# EAGLE design Stepper Driver Board (EAGLE 6.6.0)
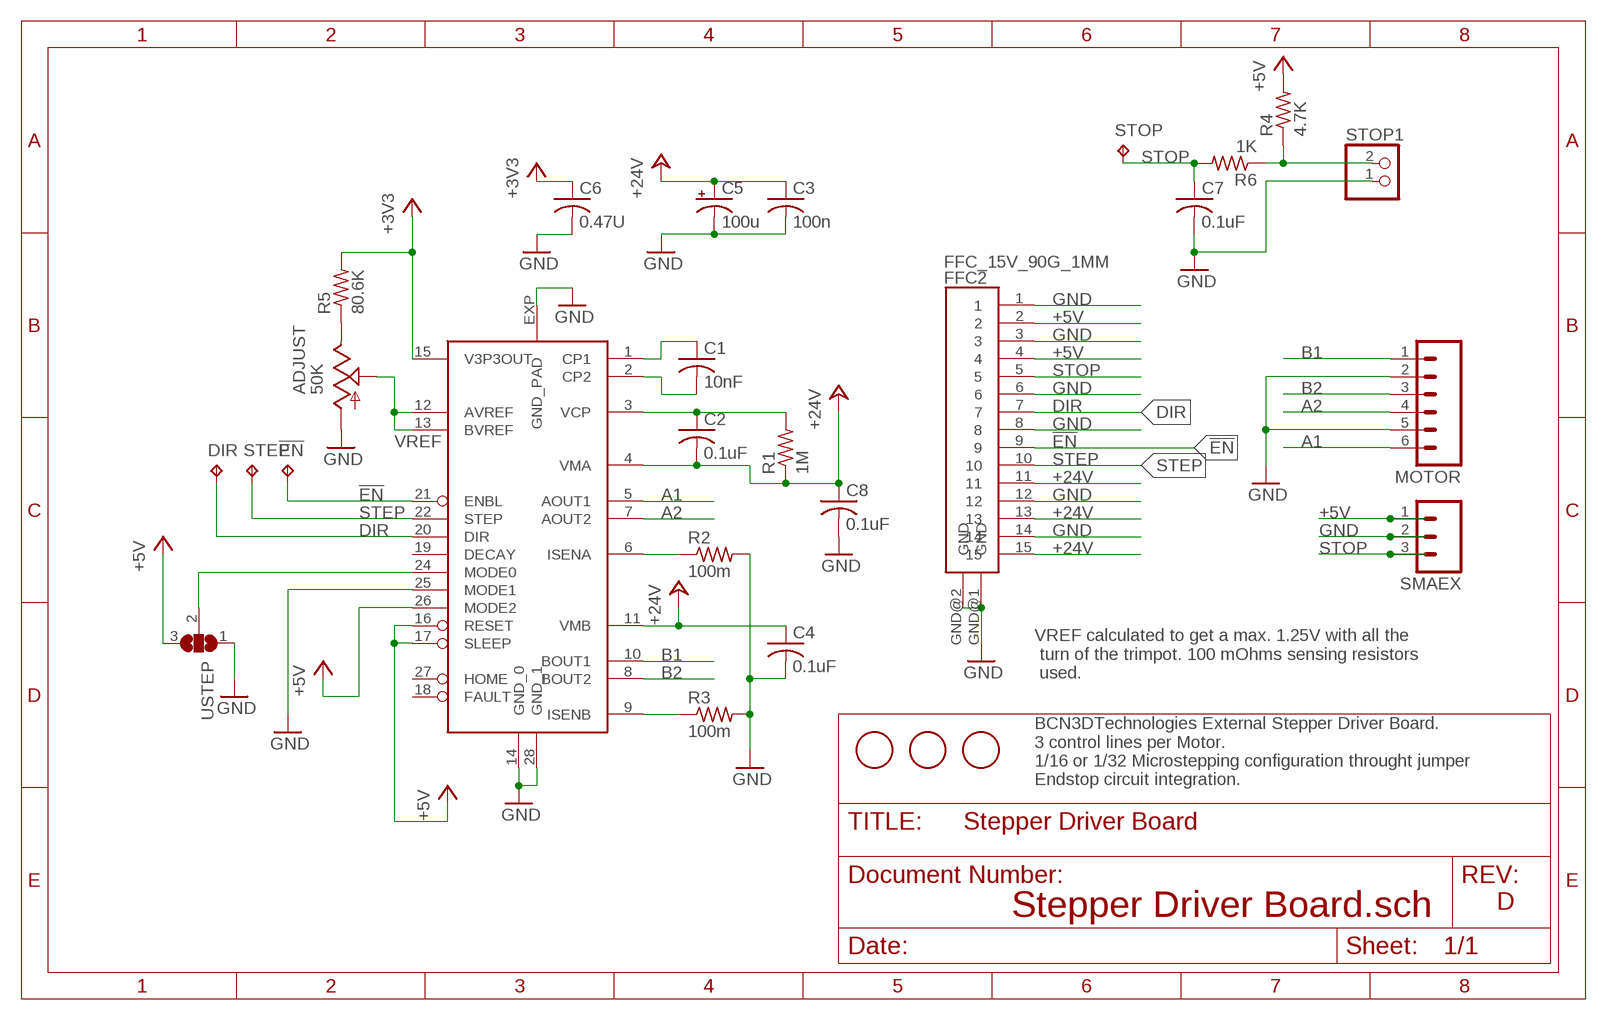
[diagram p0: schematic, sheet 1]

## Parts
!EN  TPB1,27  [B1,27]
ADJUST  50K  TRIM_US-3223G  [3223G]
C1  10nF  C-USC0805  [C0805]
C2  0.1uF  C-USC0805  [C0805]
C3  100n  C-USC0805  [C0805]
C4  0.1uF  C-USC0805  [C0805]
C5  100u  CPOL-USUD-6,3X7,7  [UD-6,3X7,7_NICHICON]
C6  0.47U  C-USC0805  [C0805]
C7  0.1uF  C-USC0805  [C0805]
C8  0.1uF  C-USC0805  [C0805]
DIR  TPB1,27  [B1,27]
FFC2  FFC_15V_90G_1MM  [TE_FFC_CON1MM]
IC1  DRV8825PWP  [TSSOP-28]
MOTOR  M06  [JST-6-PTH]
R1  1M  R-US_R0805  [R0805]
R2  100m  R-US_R1210  [R1210]
R3  100m  R-US_R1210  [R1210]
R4  4.7K  R-US_R0805  [R0805]
R5  80.6K  R-US_R0805  [R0805]
R6  1K  R-US_R0805  [R0805]
SMAEX  M03PTH  [1X03]
STEP  TPB1,27  [B1,27]
STOP  TPB1,27  [B1,27]
STOP1  JST_2PIN-THM-RA  [JST-PH-2-THM-RA]
U$2  FIDUCIAL  [FIDUCIAL_1MM]
U$3  FIDUCIAL  [FIDUCIAL_1MM]
U$4  FIDUCIAL  [FIDUCIAL_1MM]
USTEP  SJ2W  [SJ_2]

## Nets
!EN: !EN.TP FFC2.9 IC1.21(ENBL)
+3V3: C6.1 IC1.15(V3P3OUT) R5.2
+5V [Signal]: FFC2.2 FFC2.4 IC1.16(RESET) IC1.17(SLEEP) IC1.26(MODE2) R4.2 SMAEX.1 USTEP.3
+24V: C2.2 C3.1 C4.1 C5.+ C8.1 FFC2.11 FFC2.13 FFC2.15 IC1.4(VMA) IC1.11(VMB) R1.1
A1: IC1.5(AOUT1) MOTOR.6
A2: IC1.7(AOUT2) MOTOR.4
B1: IC1.10(BOUT1) MOTOR.1
B2: IC1.8(BOUT2) MOTOR.3
DIR: DIR.TP FFC2.7 IC1.20(DIR)
GND: ADJUST.1(A) C3.2 C4.2 C5.- C6.2 C7.2 C8.2 FFC2.1 FFC2.3 FFC2.6 FFC2.8 FFC2.12 FFC2.14 FFC2.GND@1(GND) FFC2.GND@2(GND) IC1.14(GND_0) IC1.25(MODE1) IC1.28(GND_1) IC1.EXP(GND_PAD) MOTOR.2 MOTOR.5 R2.2 R3.2 SMAEX.2 STOP1.1 USTEP.1
N$2: ADJUST.3(E) R5.1
N$4: IC1.24(MODE0) USTEP.2
N$7: IC1.6(ISENA) R2.1
N$8: IC1.9(ISENB) R3.1
N$11: C1.1 IC1.1(CP1)
N$12: C1.2 IC1.2(CP2)
N$14: C2.1 IC1.3(VCP) R1.2
N$25: R4.1 R6.1 STOP1.2
STEP: FFC2.10 IC1.22(STEP) STEP.TP
STOP: C7.1 FFC2.5 R6.2 SMAEX.3 STOP.TP
VREF: ADJUST.2(S) IC1.12(AVREF) IC1.13(BVREF)
Unconnected: IC1.18(FAULT) IC1.19(DECAY) IC1.27(HOME)

## Notes on the sheet
- VREF calculated to get a max. 1.25V with all the
   turn of the trimpot. 100 mOhms sensing resistors
   used.
- BCN3DTechnologies External Stepper Driver Board. 
  3 control lines per Motor.
  1/16 or 1/32 Microstepping configuration throught jumper
  Endstop circuit integration.
- D
- Stepper Driver Board.sch

## Library data of the parts
!EN DIR STEP STOP = testpad:TP: Test pad; OC_FARNELL: unknown
ADJUST = pot:TRIM_US-: POTENTIOMETER; MF: BOURNS; MPN: TC33X-2-503E; OC_FARNELL: 1689867
C1 = rcl:C-US: CAPACITOR, American symbol; MF: AVX; MPN: 06035C103JAT2A; OC_FARNELL: 1833871
C2-C4 C7 C8 = rcl:C-US: CAPACITOR, American symbol; MF: AVX; MPN: 08055C104K4Z2A; OC_FARNELL: 1301717
C5 = rcl:CPOL-US: POLARIZED CAPACITOR, American symbol; MF: PANASONIC ELECTRONIC COMPONENTS; MPN: EEE1HA101UAP; OC_FARNELL: 2326148
C6 = rcl:C-US: CAPACITOR, American symbol; MF: KEMET; MPN: C0805C474K5RACTU; OC_FARNELL: 1907053
FFC2 = MarcEagleParts:FFC_15V_90G_1MM; OC_FARNELL: unknown
IC1 = MarcEagleParts:DRV8825PWP; MF: TEXAS INSTRUMENTS; MPN: DRV8825PWP; OC_FARNELL: 1903642
MOTOR = MarcEagleParts:M06: Header 6 Standard 6-pin 0.1" header. Use with straight break away headers (SKU : PRT-00116), right angle break away headers (PRT-00553), swiss pins (PRT-00743), machine pins (PRT-00117), and female headers (PRT-00115). Molex polarized connector foot print use with SKU : PRT-08094 with associated crimp pins and housings. NOTES ON THE VARIANTS LOCK and LOCK_LONGPADS... This footprint was designed to help hold the alignment of a through-hole component (i.e. 6-pin header) while soldering it into place. You may notice that each hole has been shifted either up or down by 0.005 of an inch from it's more standard position (which is a perfectly straight line). This slight alteration caused the pins (the squares in the middle) to touch the edges of the holes. Because they are alternating, it causes a "brace" to hold the component in place. 0.005 has proven to be the perfect amount of "off-center" position when using our standard breakaway headers. Although looks a little odd when you look at the bare footprint, once you have a header in there, the alteration is very hard to notice. Also,if you push a header all the way into place, it is covered up entirely on the bottom side. This idea of altering the position of holes to aid alignment will be further integrated into the Sparkfun Library for other footprints. It can help hold any component with 3 or more connection pins.; OC_FARNELL: unknown
R1 = rcl:R-US_: RESISTOR, American symbol; MF: MULTICOMP; MPN: MC0805S8F1004T5E; OC_FARNELL: 1646371
R2 R3 = rcl:R-US_: RESISTOR, American symbol; MF: PANASONIC ELECTRONIC COMPONENTS; MPN: ERJ14BSFR10U; OC_FARNELL: 1717919
R4 = rcl:R-US_: RESISTOR, American symbol; MF: PANASONIC ELECTRONIC COMPONENTS; MPN: ERJP06F4701V; OC_FARNELL: 1750763
R5 = rcl:R-US_: RESISTOR, American symbol; MF: VISHAY DALE; MPN: CRCW080580K6FKEA; OC_FARNELL: 1152472
R6 = rcl:R-US_: RESISTOR, American symbol; MF: BOURNS; MPN: CR0805-JW-102ELF; OC_FARNELL: 2008389
SMAEX = SparkFun-Connectors:M03: Header 3 Standard 3-pin 0.1" header. Use with straight break away headers (SKU : PRT-00116), right angle break away headers (PRT-00553), swiss pins (PRT-00743), machine pins (PRT-00117), and female headers (PRT-00115). Molex polarized connector foot print use with SKU : PRT-08232 with associated crimp pins and housings.; OC_FARNELL: unknown
STOP1 = adafruit:JST_2PIN: JST 2-Pin Connectors of various flavors SMT-RA (S2B-PH-SM4) 4UConnector #17311 SMT (B2B-PH-SM4) THM-RA (S2B-PH) THM (B2B-PH); OC_FARNELL: unknown
U$2-U$4 = adafruit:FIDUCIAL: For use by pick and place machines to calibrate the vision/machine, 1mm By microbuilder.eu; OC_FARNELL: unknown
USTEP = jumper:SJ2W: SMD solder JUMPER; OC_FARNELL: unknown

## Net classes
0 Mini Power: width 0.254 mm, drill 0.254 mm, clearance 0.254 mm
1 Medium Power: width 0.305 mm, drill 0.254 mm, clearance 0.305 mm
2 High Power: width 2.54 mm, drill 0.508 mm, clearance 0.508 mm
3 Signal: width 0.229 mm, drill 0.229 mm, clearance 0.229 mm

## Board
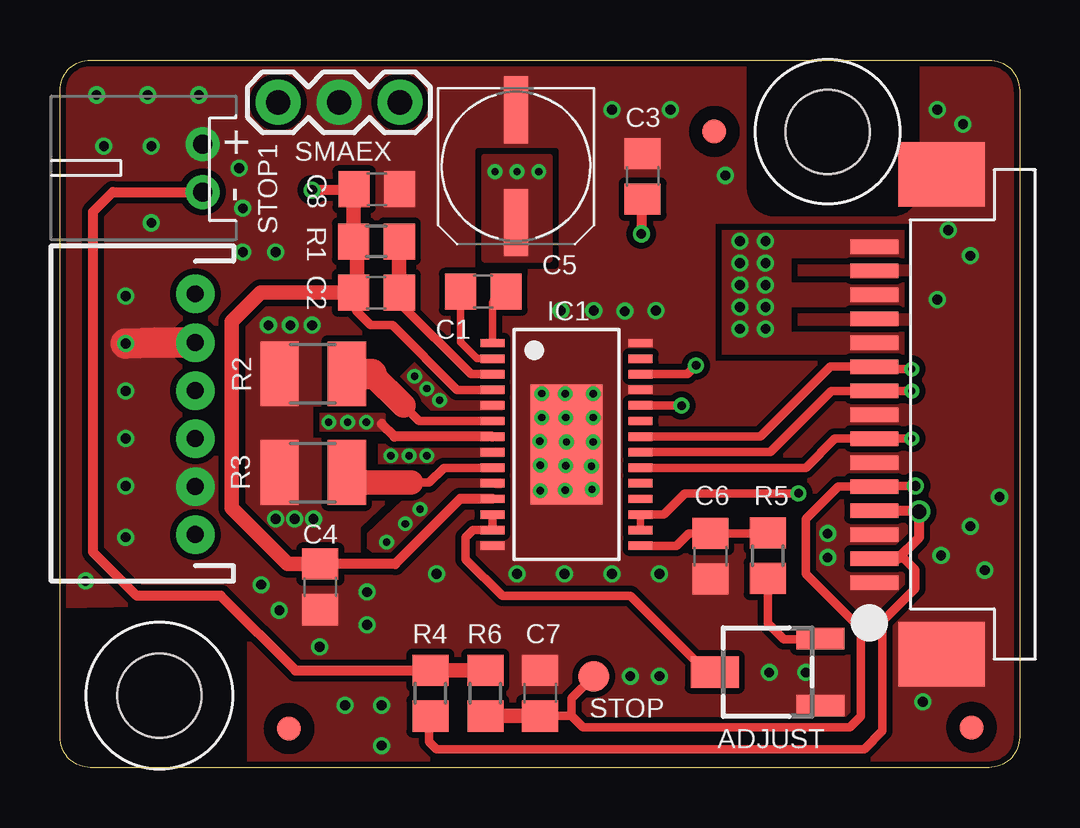
[diagram p1: board, top side]
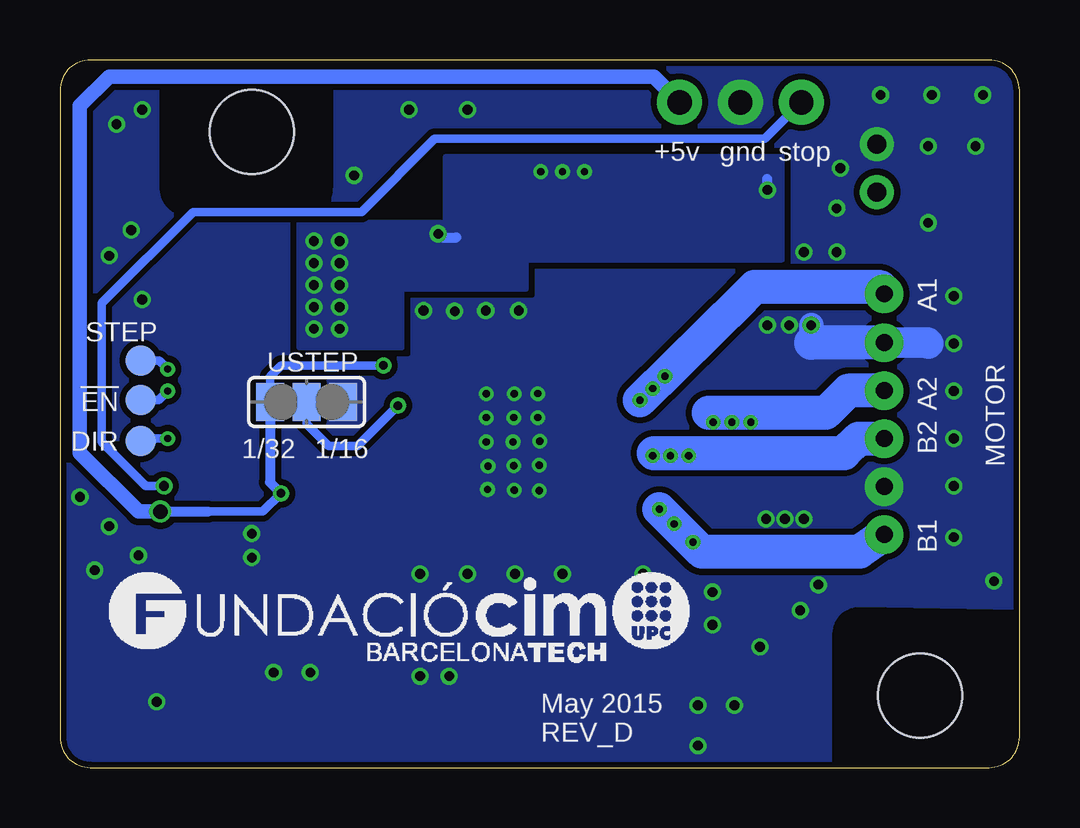
[diagram p2: board, bottom side, seen from below]

Size 40 x 29.5 mm. Coordinates in mm from the lower left corner, seen from the top.
Outline: 38.73,0 1.27,0 arc-90 0,1.27 0,28.23 arc-90 1.27,29.5 38.73,29.5 arc-90 40,28.23 40,1.27 arc-90 38.73,0
Copper layers (1*16): Top 0.035mm / dielectric 1.5mm / Bottom 0.035mm
Design rules "ITEADstudio_DRC": minimum track width 6mil, minimum drill 12mil, track to track 6mil, track to pad 6mil, pad to pad 6mil, via to via 6mil, smd to smd 0mil, copper to edge 10mil, drill to drill 10mil, minimum pad ring 10mil, minimum via ring 6mil, stop-mask expansion 2mil, vias tented up to drill 100mil, thermal gap 10mil
Holes 3.5 mm at 32,26.5 4.15,3

### Footprints (pad centres in the part's own frame; a part is rotated, then mirrored left to right if it is on the bottom)
B1,27 = smd 1.27 x 1.27: TP 0,0
3223G = smd 2 x 0.9: 1 -2.2,1.4; 3 -2.2,-1.4 | smd 2 x 1.3: 2 2.2,0
C0805 = smd 1.3 x 1.5: 1 -0.95,0; 2 0.95,0
UD-6,3X7,7_NICHICON = smd 2.8 x 1: + 2.35,0; - -2.35,0
TE_FFC_CON1MM = smd 0.61 x 2: 1 -7.01,2.8; 2 -6.01,2.8; 3 -5.01,2.8; 4 -4.01,2.8; 5 -3.01,2.8; 6 -2.01,2.8; 7 -1.01,2.8; 8 -0.01,2.8; 9 0.99,2.8; 10 1.99,2.8; 11 2.99,2.8; 12 3.99,2.8; 13 4.99,2.8; 14 5.99,2.8; 15 6.99,2.8 | smd 2.68 x 3.6: GND@1 -10,0; GND@2 10,0
TSSOP-28 = smd 0.35 x 1: 1 -4.225,-3.087; 2 -3.575,-3.087; 3 -2.925,-3.087; 4 -2.275,-3.087; 5 -1.625,-3.087; 6 -0.975,-3.087; 7 -0.325,-3.087; 8 0.325,-3.087; 9 0.975,-3.087; 10 1.625,-3.087; 11 2.275,-3.087; 12 2.925,-3.087; 13 3.575,-3.087; 14 4.225,-3.087; 15 4.225,3.087; 16 3.575,3.087; 17 2.925,3.087; 18 2.275,3.087; 19 1.625,3.087; 20 0.975,3.087; 21 0.325,3.087; 22 -0.325,3.087; 23 -0.975,3.087; 24 -1.625,3.087; 25 -2.275,3.087; 26 -2.925,3.087; 27 -3.575,3.087; 28 -4.225,3.087 | smd 5 x 3: EXP 0,0
JST-6-PTH = drill 0.7 pad 1.6: 1 -4,0; 2 -2,0; 3 0,0; 4 2,0; 5 4,0; 6 6.032,0; D 4,0
R0805 = smd 1.3 x 1.5: 1 -0.95,0; 2 0.95,0
R1210 = smd 1.6 x 2.7: 1 -1.4,0; 2 1.4,0
1X03 = drill 1.016 pad 1.88: 1 0,0; 2 2.54,0; 3 5.08,0
JST-PH-2-THM-RA = drill 0.8 pad 1.422: 1 1,0; 2 -1,0
FIDUCIAL_1MM = smd 1 x 1: 1 0,0
SJ_2 = smd 1.168 x 1.6: 1 -1.524,0; 2 0,0; 3 1.524,0

### Placement (x,y rotation side)
!EN  36.63,15.31 0 bottom
ADJUST  29.5,3.98 180 top
C1  17.65,19.84 180 top
C2  13.19,19.8 180 top
C3  24.29,24.65 90 top
C4  10.85,7.53 270 top
C5  19.01,25.06 270 top
C6  27.11,8.81 270 top
C7  20.02,3.1 90 top
C8  13.21,24.1 0 top
DIR  36.63,13.61 0 bottom
FFC2  36.75,14.72 90 top
IC1  21.11,13.47 270 top
MOTOR  5.64,13.72 90 top
R1  13.19,21.93 0 top
R2  10.56,16.42 180 top
R3  10.56,12.3 180 top
R4  15.44,3.1 270 top
R5  29.5,8.83 90 top
R6  17.73,3.1 270 top
SMAEX  14.17,27.74 180 top
STEP  36.63,16.98 0 bottom
STOP  22.25,3.81 0 top
STOP1  5.94,24.99 90 top
U$2  38,1.68 0 top
U$3  9.55,1.63 0 top
U$4  27.28,26.52 0 top
U$5  [FCIM_LOGO]  39.78,0.76 0 bottom
USTEP  29.72,15.24 180 bottom

### Tracks (layer width: path | path; a pad name or v marks a point on that pad's centre or on a via)
!EN  (via drill 0.3)
  Top 0.356: IC1.21 29.61,13.15 32.16,15.7 33.93,15.7 FFC2.9 33.96,15.7 v35.51,15.7
  Bottom 0.356: !EN.TP 35.89,15.31 v35.51,15.7
+3V3
  Top 0.356: IC1.15 25.71,9.25 26.21,9.75 C6.1 29.48,9.76 R5.2
+5V  (via drill 0.36, 0.61)
  Top 0.305: IC1.17 IC1.16
  Top 0.356: IC1.26 26.15,16.4 v26.52,16.76 | FFC2.2 35.18,8.71 35.66,8.23 35.66,7.47 34.29,6.1 34.29,1.52 33.53,0.76 15.7,0.76 15.39,1.07 15.39,2.1 R4.2 | IC1.17 25.18,10.55 26.06,11.43 v30.79,11.43
  Top 0.406: FFC2.4 35.77,10.71 v35.81,10.67 35.81,9.6 34.93,8.71 FFC2.2
  Bottom 0.356: v26.52,16.76 30.79,16.76 31.24,16.31 USTEP.3 | v30.79,11.43 31.55,10.67 v35.81,10.67
  Bottom 0.406: v35.81,10.67 33.83,10.67 | USTEP.3 31.24,11.89 v30.79,11.43
  Bottom 0.61: SMAEX.1 15.24,28.8 37.95,28.8 39.17,27.58 39.17,13.11 36.73,10.67 v35.81,10.67
+24V  (via drill 0.3, 0.41)
  Top 0.356: 12.19,19.75 C2.2 12.34,19.7 12.34,19.05 12.95,18.44 13.87,18.44 16.56,15.75 IC1.4
  Top 0.406: R1.1 12.56,21.64 | C2.2 12.55,19.46 | IC1.11 16.68,11.2 13.97,8.48 C4.1 | C3.1 24.23,23.64 v24.23,22.25 | C8.1 12.23,24.08 v10.52,24.08
  Top 0.61: C4.1 9.5,8.48 7.16,10.82 7.16,18.59 8.37,19.8 C2.2 12.38,19.96 12.38,21.79 R1.1 12.24,24.09 C8.1
  Bottom 0.406: v24.23,22.25 24.08,22.1 23.47,22.1 | v10.52,24.08 10.52,24.54
  other vias: 28.35,21.95 29.41,21.95 29.41,21.03 28.35,21.03 28.35,20.12 29.41,20.12 29.41,19.2 28.35,19.2 28.35,18.29 29.41,18.29 18.14,24.84 19.05,24.84 19.96,24.84
  pour Top (no thermals): 35.2,22.4 27.58,22.4 27.58,17.22 35.2,17.22 35.2,18.16 30.48,18.16 30.48,19.2 35.2,19.2 35.2,20.22 30.48,20.22 30.48,21.23 35.2,21.23
  pour Bottom (no thermals): 9.91,21.18 9.91,25.45 23.93,25.45 23.93,22.71 30.02,22.71 30.02,17.53 25.76,17.53 25.76,19.96 20.57,19.96 20.57,21.18
  pour Top (no thermals): 17.68,25.45 17.68,21.18 20.42,21.18 20.42,25.45
A1  (via drill 0.3)
  Bottom 1.422: 11.34,19.75 11.51,19.58 | 11.51,19.58 v15.82,15.32 | 11.51,19.58 11.05,20.04 5.93,20.04 arc90 MOTOR.6
  other vias: 15.29,15.8 14.78,16.31
  pour Top (no thermals): 18.44,15.39 16.46,15.39 14.78,16.92 14.17,16.31 14.17,16.15 15.54,14.78 18.44,14.78
A2  (via drill 0.3)
  Top 0.406: IC1.7 13.94,13.8 13.41,14.33
  Bottom 0.61: v12.78,14.4 12.95,14.58 12.95,14.78
  Bottom 1.422: MOTOR.4 7.14,15.72 8.08,14.78 12.95,14.78
  other vias: 11.99,14.4 11.2,14.4
  pour Top (no thermals): 13.41,14.78 10.82,14.78 10.82,14.02 13.56,14.02 13.56,14.78
B1  (via drill 0.3)
  Bottom 1.422: MOTOR.1 6.67,8.99 13.23,8.99 v15.01,10.77
  other vias: 14.4,10.16 13.61,9.4
  pour Top (no thermals): 18.41,11.53 18.41,12.19 15.39,12.19 12.8,9.75 12.8,9.14 13.56,8.53 16.61,11.53
B2  (via drill 0.3)
  Bottom 0.61: v15.29,13.01 15.24,13.06 15.24,13.11
  Bottom 1.422: 15.24,13.11 7.32,13.11 6.71,13.72 MOTOR.3
  other vias: 14.55,13 13.79,13
  pour Top (no thermals): 18.52,13.49 13.26,13.49 13.26,12.65 15.54,12.65 15.7,12.83 18.52,12.83
DIR  (via drill 0.3)
  Top 0.356: IC1.20 31.09,12.5 32.31,13.72 FFC2.7 35.35,13.71 v35.51,13.72
  Bottom 0.356: v35.51,13.72 36.52,13.72 DIR.TP
GND  (via drill 0.3, 0.41)
  Top 1.27: MOTOR.5 4,17.72 v2.74,17.68
  Bottom 1.016: 8.69,17.72 v8.69,18.44
  Bottom 1.27: MOTOR.5 3.85,17.72 3.81,17.68
  Bottom 1.422: MOTOR.5 8.69,17.72
  other vias: 20,13.6 21.06,15.58 22.23,15.58 22.23,14.59 21.09,14.59 21.11,13.57 22.23,13.57 20.02,12.61 21.09,12.58 22.15,12.56 22.18,11.59 21.06,11.57 20.02,11.54 20.09,14.59 20.09,15.59 37.95,10.06 36.58,27.43 36.73,8.84 29.57,3.96 31.09,3.96 7.47,24.99 8.99,21.49 7.62,21.49 7.62,23.32 22.25,19.05 24.84,19.05 8.38,7.62 37.03,22.4 39.17,11.28 8.99,10.36 9.78,10.36 10.57,10.36 9.6,18.44 10.52,18.44 38.56,8.23 23.55,19.02 3.81,25.91 2.74,19.66 2.74,15.7 13.41,0.91 5.79,28.04 1.52,28.04 3.66,28.04 1.83,25.91 3.81,22.71 24.99,3.81 15.7,8.08 12.8,7.32 9.14,6.55 10.82,5.03 37.95,21.34 36.58,19.51 35.97,2.74 23.01,8.08 21.03,8.08 19.05,8.08 20.88,19.05 2.74,13.72 2.74,9.6 2.74,11.73 23.77,3.81 13.41,2.59 11.89,2.59 12.8,5.94 32,9.75 24.99,8.08 27.74,24.69 25.45,27.43 23.01,27.43 37.64,26.82 32,8.75 1.07,7.77
  pour Top (rank 6, no thermals): 0,29.72 28.5,29.72 28.5,24.13 arc90 29.77,22.86 34.7,22.86 arc90 35.97,24.13 35.97,29.72 40.13,29.72 40.13,-0.25 7.92,-0.15 7.92,5.6 arc91 6.63,6.87 0,6.75
  pour Bottom (rank 6, no thermals): 0,29.72 28.5,29.72 28.5,24.13 arc90 29.77,22.86 34.7,22.86 arc90 35.97,24.13 35.97,29.72 40.08,29.72 40.08,-0.15 7.92,-0.15 7.92,5.56 arc91 6.63,6.83 0,6.71
N$2
  Top 0.356: R5.1 29.5,6.01 30.18,5.33 31.65,5.33 ADJUST.3
N$4  (via drill 0.36)
  Top 0.356: v25.91,15.09 24.21,15.09 IC1.24
  Bottom 0.356: USTEP.2 29.72,14.33 28.8,13.41 27.58,13.41 v25.91,15.09
N$7
  Top 0.356: IC1.6 14.96,14.45 14.33,15.09
  Top 1.016: 14.33,15.09 13,16.42
  Top 1.27: 13,16.42 R2.1
N$8
  Top 0.356: IC1.9 16,12.5 15.39,11.89 14.63,11.89
  Top 1.016: 14.63,11.89 12.37,11.89
  Top 1.27: 12.37,11.89 R3.1
N$11
  Top 0.305: 18.03,17.87 IC1.1 18.03,19.27 arc-90 C1.1
N$12
  Top 0.305: IC1.2 17.39,17.05 16.7,17.75 C1.2
N$14
  Top 0.356: IC1.3 17.13,16.4 14.14,19.39 C2.1
  Top 0.61: C2.1 R1.2
N$25
  Top 0.406: STOP1.2 2.2,23.99 1.37,23.16 1.37,8.99 3.2,7.16 6.71,7.16 9.82,4.05 R4.1
  Top 0.61: R4.1 R6.1
STEP  (via drill 0.3)
  Top 0.356: IC1.22 29.19,13.8 32.11,16.71 FFC2.10 34.05,16.61 v35.51,16.61
  Bottom 0.356: STEP.TP 35.87,16.98 v35.51,16.61
STOP  (via drill 0.41)
  Top 0.356: v35.66,11.73 33.97,11.73 FFC2.5 32.44,11.71 31.09,10.36 31.09,8.08 33.38,5.79 33.38,2.13 32.92,1.68 21.79,1.68 21.32,2.15 | 21.32,2.15 C7.1 | 21.32,2.15 21.32,2.88 STOP.TP
  Top 0.61: R6.2 C7.1
  Bottom 0.356: SMAEX.3 10.62,26.21 24.38,26.21 27.43,23.16 34.44,23.16 38.25,19.36 38.25,13.56 36.42,11.73 v35.66,11.73
VREF
  Top 0.356: IC1.12 IC1.13 18.02,9.91 17.22,9.91 16.92,9.6 16.92,8.69 18.44,7.16 23.77,7.16 26.96,3.98 ADJUST.2

### Text on the board
bPlace: stop | gnd | +5v | A1 | A2 | B2 | 1/16 | 1/32 | B1 | May 2015 / REV_D
bStop: BCN3D Electronics / Stepper Driver Board v1.0 / Designed in Barcelona
DrillLegend_01-16: 01-16
DrillLegend_01-20: 01-20